# EAGLE design aquatime (EAGLE 7.7.0)
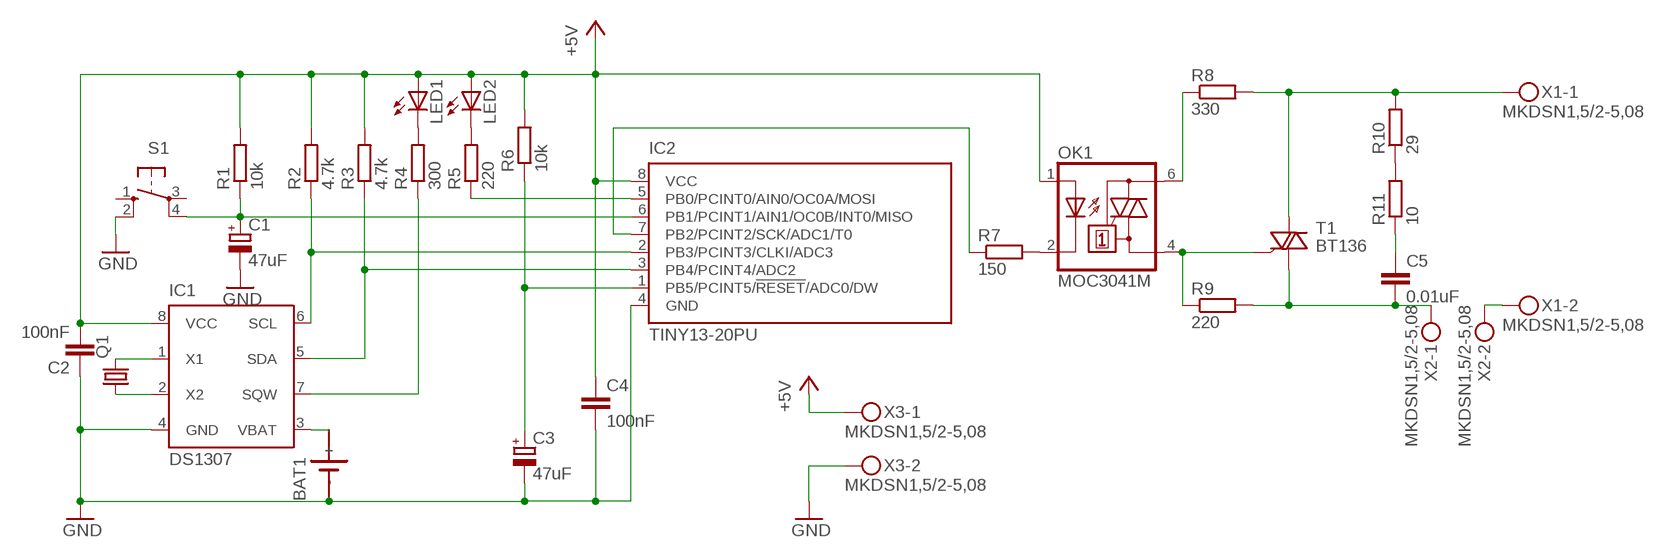
[diagram p0: schematic, sheet 1]

## Parts
BAT1  SN2032  [SN2032]
C1  47uF  CPOL-EUE2.5-6  [E2,5-6]
C2  100nF  C-EU102-064X133  [C102-064X133]
C3  47uF  CPOL-EUE2.5-6  [E2,5-6]
C4  100nF  C-EU102-064X133  [C102-064X133]
C5  0.01uF  C-EU102-064X133  [C102-064X133]
IC1  DS1307  [DIL08]
IC2  TINY13-20PU  [DIL08]
LED1  LED5MM  [LED5MM]
LED2  LED5MM  [LED5MM]
OK1  MOC3041M  [DIL06]
Q1  CRYSTALTC26H  [TC26H]
R1  10k  R-EU_0207/12  [0207/12]
R2  4.7k  R-EU_0207/10  [0207/10]
R3  4.7k  R-EU_0207/10  [0207/10]
R4  300  R-EU_0207/10  [0207/10]
R5  220  R-EU_0207/10  [0207/10]
R6  10k  R-EU_0207/12  [0207/12]
R7  150  R-EU_0207/10  [0207/10]
R8  330  R-EU_0817/22  [P0817/22]
R9  220  R-EU_0411/15  [0411/15]
R10  29  R-EU_0411/15  [0411/15]
R11  10  R-EU_0411/15  [0411/15]
S1  10-XX  [B3F-10XX]
T1  BT136  [TO220AB]
X1  MKDSN1,5/2-5,08  [MKDSN1,5/2-5,08]
X2  MKDSN1,5/2-5,08  [MKDSN1,5/2-5,08]
X3  MKDSN1,5/2-5,08  [MKDSN1,5/2-5,08]

## Nets
+5V: C2.2 C4.1 IC1.8(VCC) IC2.8(VCC) LED1.A LED2.A OK1.1(A) R1.2 R2.2 R3.2 R6.2 X3.1
GND: BAT1.- C1.- C2.1 C3.- C4.2 IC1.4(GND) IC2.4(GND) S1.2(S1) X3.2
N$1: C3.+ IC2.1(PB5/PCINT5/!RESET!/ADC0/DW) R6.1
N$2: LED2.K(C) R5.2
N$3: R10.1 R11.2
N$4: OK1.2(C) R7.2
N$5: BAT1.+ IC1.3(VBAT)
N$6: IC2.7(PB2/PCINT2/SCK/ADC1/T0) R7.1
N$7: IC1.5(SDA) IC2.3(PB4/PCINT4/ADC2) R3.1
N$8: IC1.6(SCL) IC2.2(PB3/PCINT3/CLKI/ADC3) R2.1
N$9: LED1.K(C) R4.2
N$10: IC1.7(SQW) R4.1
N$11: OK1.6(A2) R8.1
N$12: IC1.1(X1) Q1.2
N$13: IC1.2(X2) Q1.1
N$14: IC2.5(PB0/PCINT0/AIN0/OC0A/MOSI) R5.1
N$15: R8.2 R10.2 T1.2(A2) X1.1
N$16: OK1.4(A1) R9.1 T1.3(G)
N$17: C5.2 R9.2 T1.1(A1) X2.1
N$18: C5.1 R11.1
N$19: X1.2 X2.2
N$20: C1.+ IC2.6(PB1/PCINT1/AIN1/OC0B/INT0/MISO) R1.1 S1.4(P1)
Unconnected: S1.1(S) S1.3(P)

## Library data of the parts
BAT1 = sn2032:SN2032: LI BATTERY
C1 C3 = rcl:CPOL-EU: POLARIZED CAPACITOR, European symbol
C2 C4 C5 = rcl:C-EU: CAPACITOR, European symbol
IC1 = ds1307_pcf8583:DS1307: I2C-Bus CLOCK/CALENDAR
IC2 = atmel:TINY13: 8-bit AVR Microcontroller with 1K Bytes In-System Programmable Flash Source: http://www.atmel.com/dyn/resources/prod_documents/2535S.pdf; MPN: ATTINY13-20PU; OC_FARNELL: 9171550; OC_NEWARK: 96K6521
LED1 LED2 = led:LED: LED OSRAM: - CHIPLED LG R971, LG N971, LY N971, LG Q971, LY Q971, LO R971, LY R971 LH N974, LH R974 LS Q976, LO Q976, LY Q976 LO Q996 - Hyper CHIPLED LW Q18S LB Q993, LB Q99A, LB R99A - SideLED LS A670, LO A670, LY A670, LG A670, LP A670 LB A673, LV A673, LT A673, LW A673 LH A674 LY A675 LS A676, LA A676, LO A676, LY A676, LW A676 LS A679, LY A679, LG A679 - Hyper Micro SIDELEDВ® LS Y876, LA Y876, LO Y876, LY Y876 LT Y87S - SmartLED LW L88C, LW L88S LB L89C, LB L89S, LG L890 LS L89K, LO L89K, LY L89K LS L896, LA L896, LO L896, LY L896 - TOPLED LS T670, LO T670, LY T670, LG T670, LP T670 LSG T670, LSP T670, LSY T670, LOP T670, LYG T670 LG T671, LOG T671, LSG T671 LB T673, LV T673, LT T673, LW T673 LH T674 LS T676, LA T676, LO T676, LY T676, LB T676, LH T676, LSB T676, LW T676 LB T67C, LV T67C, LT T67C, LS T67K, LO T67K, LY T67K, LW E67C LS E67B, LA E67B, LO E67B, LY E67B, LB E67C, LV E67C, LT E67C LW T67C LS T679, LY T679, LG T679 LS T770, LO T770, LY T770, LG T770, LP T770 LB T773, LV T773, LT T773, LW T773 LH T774 LS E675, LA E675, LY E675, LS T675 LS T776, LA T776, LO T776, LY T776, LB T776 LHGB T686 LT T68C, LB T68C - Hyper Mini TOPLEDВ® LB M676 - Mini TOPLED SantanaВ® LG M470 LS M47K, LO M47K, LY M47K Source: http://www.osram.convergy.de LUXEON: - LUMILEDВ® LXK2-PW12-R00, LXK2-PW12-S00, LXK2-PW14-U00, LXK2-PW14-V00 LXK2-PM12-R00, LXK2-PM12-S00, LXK2-PM14-U00 LXK2-PE12-Q00, LXK2-PE12-R00, LXK2-PE12-S00, LXK2-PE14-T00, LXK2-PE14-U00 LXK2-PB12-K00, LXK2-PB12-L00, LXK2-PB12-M00, LXK2-PB14-N00, LXK2-PB14-P00, LXK2-PB14-Q00 LXK2-PR12-L00, LXK2-PR12-M00, LXK2-PR14-Q00, LXK2-PR14-R00 LXK2-PD12-Q00, LXK2-PD12-R00, LXK2-PD12-S00 LXK2-PH12-R00, LXK2-PH12-S00 LXK2-PL12-P00, LXK2-PL12-Q00, LXK2-PL12-R00 Source: www.luxeon.com KINGBRIGHT: KA-3528ASYC Source: www.kingbright.com
OK1 = optocoupler:MOC30*: 6-Pin DIP Zero-Cross Optoisolators Triac Driver Output (250/400 Volt Peak) Source: Data sheet <http://www.fairchildsemi.com/ds/MO/MOC3031M.pdf> The old path of data sheet not more available 2013-05-06.; MF: FAIRCHILD SEMICONDUCTOR; MPN: MOC3041M; OC_FARNELL: 1086677; OC_NEWARK: 78K6090
Q1 = crystal:CRYSTAL: CRYSTAL; OC_FARNELL: unknown; OC_NEWARK: unknown
R1-R11 = rcl:R-EU_: RESISTOR, European symbol
S1 = switch-omron:10-XX: OMRON SWITCH; MPN: B3F-1000; OC_FARNELL: 176432; OC_NEWARK: 36M3542
T1 = triac:BT136: Triac BT136 series E sensitive gate Source: http://www.nxp.com/acrobat_download/datasheets/BT136_SERIES_E_2.pdf
X1-X3 = con-phoenix-508:MKDSN1,5/2-5,08: MKDSN 1,5/ 2-5,08 Printklemme Nennstrom: 13,5 A Nennspannung: 250 V RastermaГџ: 5,08 mm Polzahl: 2 Anschlussart: Schraubanschluss Montage: LГ¶ten Anschlussrichtung Leiter/Platine: 0 В° Artikelnummer: 1729128 Source: http://eshop.phoenixcontact.com .. 1729128.pdf

## Net classes
0 default: width 0.813 mm

## Board
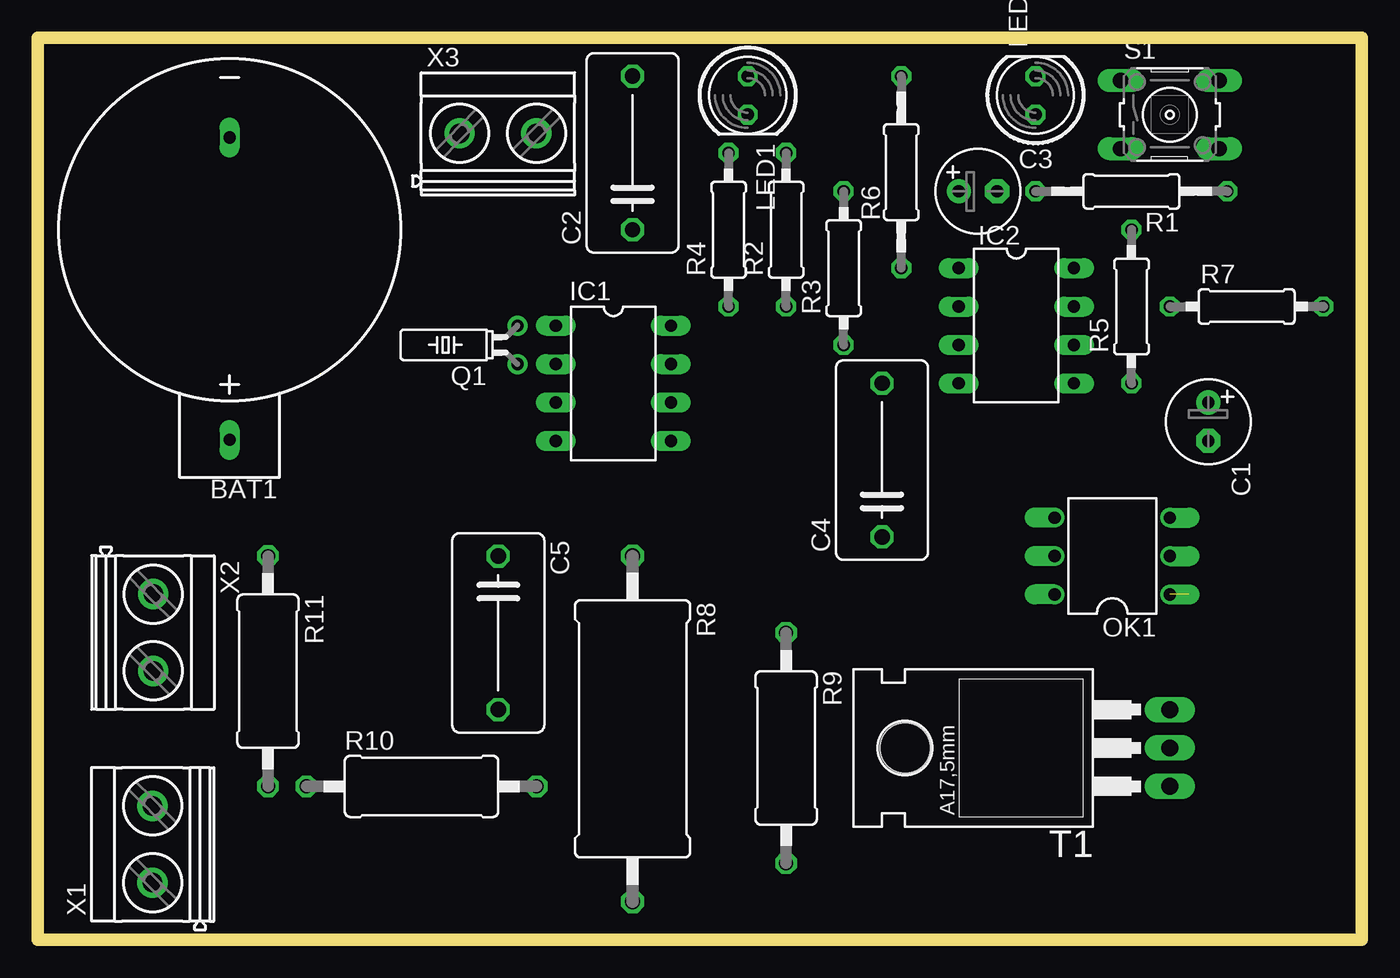
[diagram p1: board, top side]
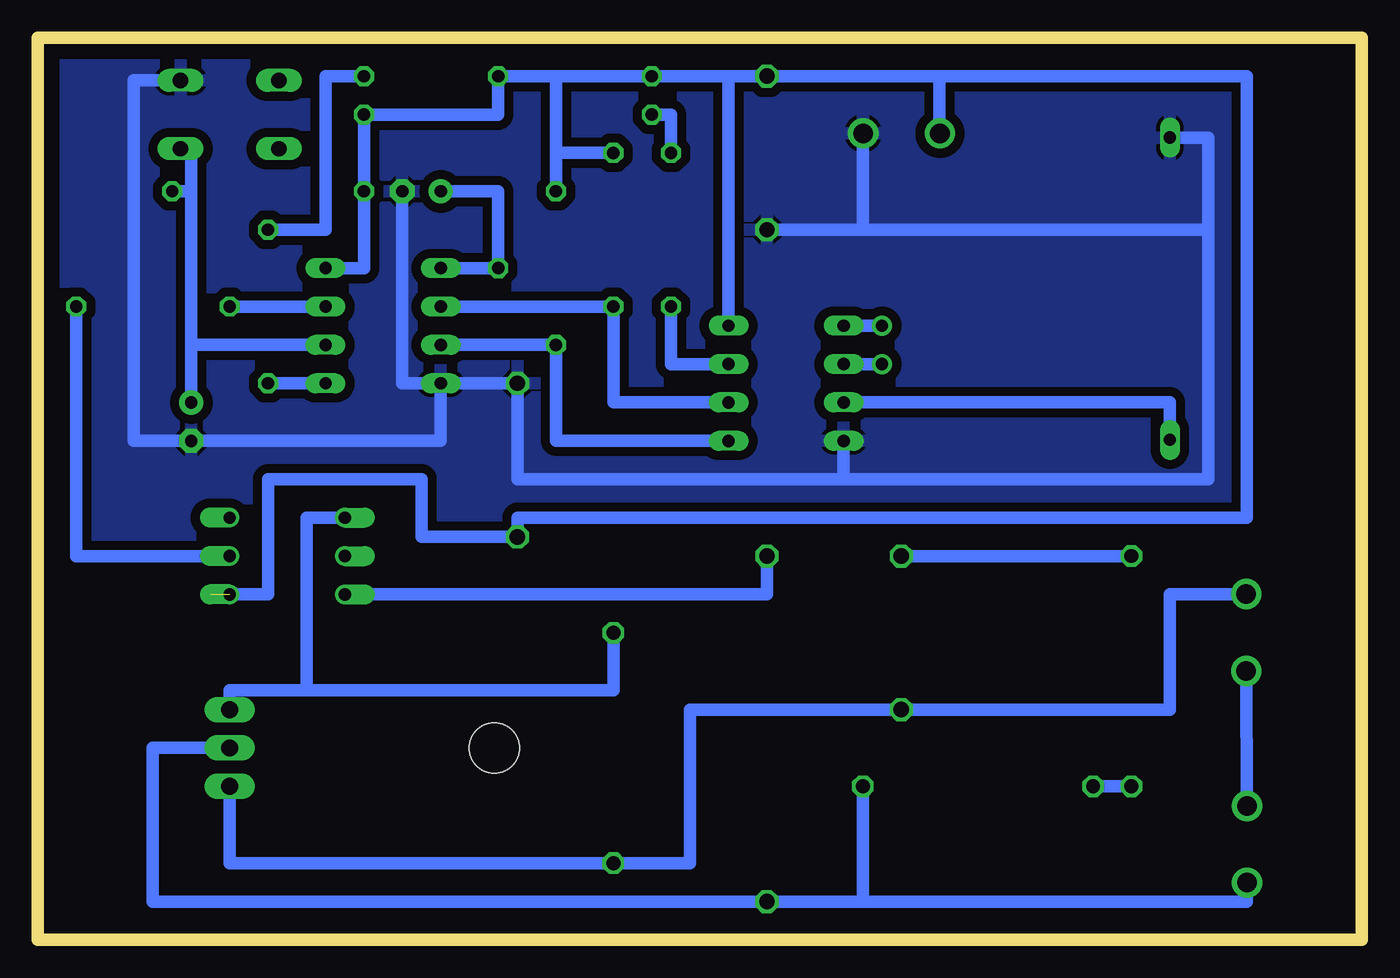
[diagram p2: board, bottom side, seen from below]

Size 87.63 x 59.69 mm. Coordinates in mm from the lower left corner, seen from the top.
Outline: 87.3,0 87.3,59.68 0,59.68 0,1.27
Outline: 87.3,0 87.63,0 87.63,59.69 0,59.69 0,1.27
Outline: 87.3,0 0,0 0,1.27
Copper layers (1*16): Top 0.035mm / dielectric 1.5mm / Bottom 0.035mm
Design rules "default *": minimum track width 28mil, minimum drill 32mil, track to track 24mil, track to pad 24mil, pad to pad 24mil, via to via 24mil, smd to smd 24mil, copper to edge 40mil, drill to drill 24mil, minimum pad ring 10mil, minimum via ring 8mil, stop-mask expansion 4mil, vias tented up to drill 0mil, thermal gap 10mil

### Footprints (pad centres in the part's own frame; a part is rotated, then mirrored left to right if it is on the bottom)
SN2032 = drill 0.813 long: + 0,13.9; - 0,-6.1
E2,5-6 = drill 0.813 pad 1.6: + -1.27,0 | drill 0.813 pad 1.6 octagon: - 1.27,0
C102-064X133 = drill 1.016 octagon: 1 -5.08,0; 2 5.08,0
DIL08 = drill 0.813 long: 1 -3.81,-3.81; 2 -1.27,-3.81; 3 1.27,-3.81; 4 3.81,-3.81; 5 3.81,3.81; 6 1.27,3.81; 7 -1.27,3.81; 8 -3.81,3.81
LED5MM = drill 0.813 octagon: A -1.27,0; K 1.27,0
DIL06 = drill 0.813 offset: 1 -2.54,-3.81; 2 0,-3.81; 3 2.54,-3.81; 4 2.54,3.81; 5 0,3.81; 6 -2.54,3.81
TC26H = drill 0.813: 1 -1.27,0; 2 1.27,0
0207/12 = drill 0.813 octagon: 1 -6.35,0; 2 6.35,0
0207/10 = drill 0.813 octagon: 1 -5.08,0; 2 5.08,0
P0817/22 = drill 1.016 octagon: 1 -11.43,0; 2 11.43,0
0411/15 = drill 0.914 octagon: 1 -7.62,0; 2 7.62,0
B3F-10XX = drill 1.016 long: 1 -3.251,2.261; 2 3.251,2.261; 3 -3.251,-2.261; 4 3.251,-2.261
TO220AB = drill 1.118 long: 1 -2.54,-6.35; 2 0,-6.35; 3 2.54,-6.35 | hole 3.302: 0,11.176
MKDSN1,5/2-5,08 = drill 1.3 pad 2: 1 -2.561,0.025; 2 2.519,0.025

### Placement (x,y rotation side)
BAT1  12.7,46.99 180 top
C1  77.47,34.29 270 top
C2  39.37,52.07 90 top
C3  62.23,49.53 0 top
C4  55.88,31.75 90 top
C5  30.48,20.32 270 top
IC1  38.1,36.83 270 top
IC2  64.77,40.64 270 top
LED1  46.99,55.88 270 top
LED2  66.04,55.88 90 top
OK1  71.12,25.4 90 top
Q1  31.75,39.37 90 top
R1  72.39,49.53 180 top
R2  49.53,46.99 90 top
R3  53.34,44.45 90 top
R4  45.72,46.99 90 top
R5  72.39,41.91 90 top
R6  57.15,50.8 90 top
R7  80.01,41.91 0 top
R8  39.37,13.97 270 top
R9  49.53,12.7 270 top
R10  25.4,10.16 0 top
R11  15.24,17.78 270 top
S1  74.93,54.61 0 top
T1  68.58,12.7 90 top
X1  7.62,6.35 90 top
X2  7.62,20.32 270 top
X3  30.48,53.34 0 top

### Tracks (layer width: path | path; a pad name or v marks a point on that pad's centre or on a via)
+5V  (1 unrouted)
  Bottom 0.813: 41.91,57.15 LED1.A 53.34,57.15 | 41.91,57.15 C2.2 27.94,57.15 | 27.94,57.15 7.62,57.15 7.62,27.94 55.88,27.94 C4.1 62.23,26.67 62.23,30.48 72.39,30.48 72.39,22.86 76.2,22.86 | IC1.8 41.91,57.15 | X3.1 27.94,53.37 27.94,57.15 | 53.34,57.15 53.34,52.07 | 53.34,52.07 R3.2 | 53.34,57.15 R6.2 57.15,54.61 LED2.A R1.2 66.04,44.45 IC2.8 | R2.2 53.34,52.07
GND
  Bottom 0.813: IC1.4 34.29,30.48 | 34.29,30.48 10.16,30.48 10.16,46.99 | 10.16,46.99 10.16,53.09 BAT1.- | X3.2 33.02,53.37 33.02,46.99 | 33.02,46.99 10.16,46.99 | C2.1 33.02,46.99 | 34.29,30.48 55.88,30.48 C4.2 IC2.4 | IC2.4 60.96,33.02 C1.- 81.28,33.02 81.28,56.87 S1.2 | C3.- 63.5,36.83 IC2.4
  pour Bottom: 0,59.69 87.63,59.69 87.63,0 0,0
N$1
  Bottom 0.813: IC2.1 R6.1 57.15,49.53 C3.+
N$2
  Bottom 0.813: LED2.K 68.58,57.15 68.58,46.99 R5.2
N$3
  Bottom 0.813: R11.2 R10.1
N$4
  Bottom 0.813: R7.2 85.09,25.4 OK1.2
N$5
  Bottom 0.813: IC1.3 12.7,35.56 BAT1.+
N$6
  Bottom 0.813: IC2.7 R7.1
N$7
  Bottom 0.813: IC1.5 53.34,33.02 R3.1 IC2.3
N$8
  Bottom 0.813: IC1.6 49.53,35.56 R2.1 IC2.2
N$9
  Bottom 0.813: R4.2 45.72,54.61 LED1.K
N$10
  Bottom 0.813: IC1.7 45.72,38.1 R4.1
N$11
  Bottom 0.813: OK1.6 39.37,22.86 R8.1
N$12
  Bottom 0.813: Q1.2 IC1.1
N$13
  Bottom 0.813: Q1.1 IC1.2
N$14
  Bottom 0.813: IC2.5 R5.1
N$15
  Bottom 0.813: T1.2 80.01,12.7 80.01,2.54 R8.2 33.02,2.54 | 33.02,2.54 7.59,2.54 X1.1 | R10.2 33.02,2.54
N$16
  Bottom 0.813: R9.1 49.53,16.51 69.85,16.51 | 69.85,16.51 74.93,16.51 T1.3 | OK1.4 69.85,27.94 69.85,16.51
N$17
  Bottom 0.813: T1.1 74.93,5.08 R9.2 44.45,5.08 44.45,15.24 C5.2 12.7,15.24 12.7,22.86 7.64,22.86 X2.1
N$18
  Bottom 0.813: C5.1 R11.1
N$19
  Bottom 0.813: X2.2 X1.2
N$20
  Bottom 0.813: 77.47,49.53 77.47,52.35 S1.4 | 77.47,49.53 77.47,39.37 | 77.47,39.37 C1.+ | IC2.6 77.47,39.37 | R1.1 77.47,49.53